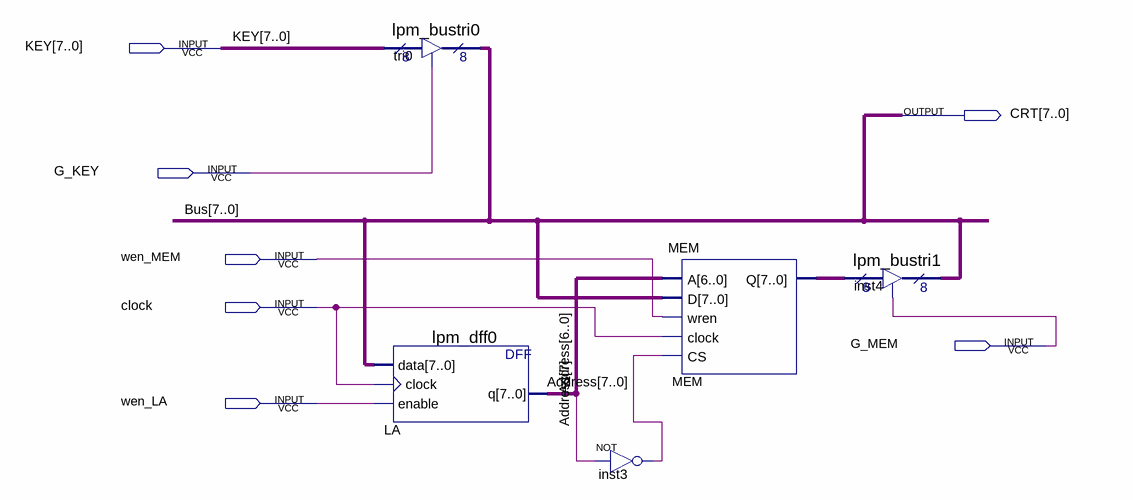
[diagram p0: schematic sheet]
// Quartus schematic Bus.bdf as structural Verilog: 5 symbols, 7 pins
module Bus (
  input  [7:0] KEY,
  input  G_KEY,
  input  wen_MEM,
  input  clock,
  input  G_MEM,
  input  wen_LA,
  output [7:0] CRT
);

  wire inst3_out;
  wire [7:0] Address, MEM_q;

  lpm_bustri0 \tri0  (.enabledt(G_KEY), .data(KEY), .tridata(CRT));
  lpm_dff0 LA (.data(CRT), .clock(clock), .enable(wen_LA), .q(Address));
  not inst3 (inst3_out, Address[7]);
  MEM MEM (.A(Address[6:0]), .D(CRT), .wren(wen_MEM), .clock(clock), .CS(inst3_out), .Q(MEM_q));
  lpm_bustri1 inst4 (.enabledt(G_MEM), .data(MEM_q), .tridata(CRT));

  // Other names for the same wires on the sheet: Bus[7:0] = CRT
endmodule
